# Altium schematic sheet LCDTFT_FPC40P_LVDS.SchDoc
size A3
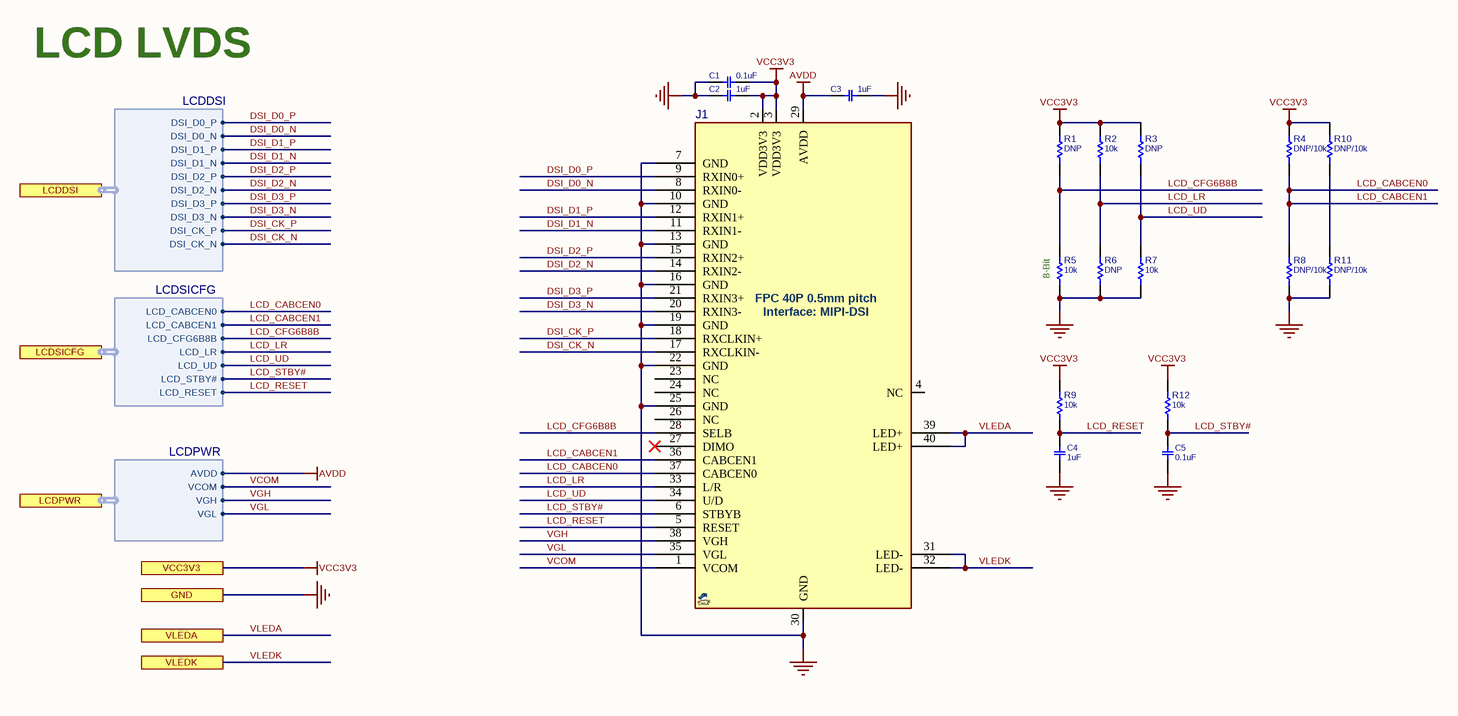
[diagram p0: LCDTFT_FPC40P_LVDS.SchDoc]

## Parts
C1  0.1uF  [C0402]
C2  1uF  [C0402]
C3  1uF  [C0402]
C4  1uF  [C0402]
C5  0.1uF  [C0402]
J1  FPC_40_0.5mm  [FPC50_40]  (value not drawn)
R1  DNP  [R0402]
R2  10k  [R0402]
R3  DNP  [R0402]
R4  DNP/10k  [R0402]
R5  10k  [R0402]
R6  DNP  [R0402]
R7  10k  [R0402]
R8  DNP/10k  [R0402]
R9  10k  [R0402]
R10  DNP/10k  [R0402]
R11  DNP/10k  [R0402]
R12  10k  [R0402]

## Ports
GND, LCDDSI (harness LCDDSI), LCDPWR (harness LCDPWR), LCDSICFG (harness LCDSICFG), VCC3V3, VLEDA, VLEDK

## Harnesses
LCDDSI: DSI_D0_P, DSI_D0_N, DSI_D1_P, DSI_D1_N, DSI_D2_P, DSI_D2_N, DSI_D3_P, DSI_D3_N, DSI_CK_P, DSI_CK_N
LCDPWR: AVDD, VGH, VCOM, VGL
LCDSICFG: LCD_CABCEN0, LCD_CABCEN1, LCD_CFG6B8B, LCD_LR, LCD_UD, LCD_STBY#, LCD_RESET

## Nets
AVDD: C3.2 J1.29(AVDD) ; port LCDPWR.AVDD
GND: C1.2 C2.2 C3.1 C4.2 C5.2 J1.7(GND) J1.10(GND) J1.13(GND) J1.16(GND) J1.19(GND) J1.22(GND) J1.25(GND) J1.30(GND) R5.2 R6.2 R7.2 R8.2 R11.2 ; port GND
VCC3V3: C1.1 C2.1 J1.2(VDD3V3) J1.3(VDD3V3) R1.1 R2.1 R3.1 R4.1 R9.1 R10.1 R12.1 ; port VCC3V3
DSI_CK_N: J1.17(RXCLKIN-) ; port LCDDSI.DSI_CK_N
DSI_CK_P: J1.18(RXCLKIN+) ; port LCDDSI.DSI_CK_P
DSI_D0_N: J1.8(RXIN0-) ; port LCDDSI.DSI_D0_N
DSI_D0_P: J1.9(RXIN0+) ; port LCDDSI.DSI_D0_P
DSI_D1_N: J1.11(RXIN1-) ; port LCDDSI.DSI_D1_N
DSI_D1_P: J1.12(RXIN1+) ; port LCDDSI.DSI_D1_P
DSI_D2_N: J1.14(RXIN2-) ; port LCDDSI.DSI_D2_N
DSI_D2_P: J1.15(RXIN2+) ; port LCDDSI.DSI_D2_P
DSI_D3_N: J1.20(RXIN3-) ; port LCDDSI.DSI_D3_N
DSI_D3_P: J1.21(RXIN3+) ; port LCDDSI.DSI_D3_P
LCD_CABCEN0: J1.36(CABCEN1) J1.37(CABCEN0) R4.2 R8.1 ; port LCDSICFG.LCD_CABCEN0, port LCDSICFG.LCD_CABCEN1  [also labelled LCD_CABCEN1]
LCD_CFG6B8B: J1.28(SELB) R1.2 R5.1 ; port LCDSICFG.LCD_CFG6B8B
LCD_LR: J1.33(L/R) R2.2 R6.1 ; port LCDSICFG.LCD_LR
LCD_RESET: C4.1 J1.5(RESET) R9.2 ; port LCDSICFG.LCD_RESET
LCD_STBY#: C5.1 J1.6(STBYB) R12.2 ; port LCDSICFG.LCD_STBY#
LCD_UD: J1.34(U/D) R3.2 R7.1 ; port LCDSICFG.LCD_UD
VCOM: J1.1(VCOM) ; port LCDPWR.VCOM
VGH: J1.38(VGH) ; port LCDPWR.VGH
VGL: J1.35(VGL) ; port LCDPWR.VGL
VLEDA: J1.39(LED+) J1.40(LED+) ; port VLEDA
VLEDK: J1.31(LED-) J1.32(LED-) ; port VLEDK
NetR10_2: R10.2 R11.1

Not connected (* = marked no-connect by the designer): J1 4(NC) 23(NC) 24(NC) 26(NC) 27(DIMO)*

## Notes on the sheet
- LCD LVDS
- (near R5) 8-Bit
- (in symbol LCDTFT_DSI_FPC40P) FPC 40P 0.5mm pitch; Interface: MIPI-DSI

## Library data of the parts
C1 C5 = CAP_SMD_MLCC: CAP, MLCC; PARAM: X7R, 10%, -55~125oC; MANF_P#: GRM155R71H104KE14D; MANF: Murata; PARAM2: 50v; PRICE: 100: 0.018$; ASSEMBLY: ASSEMBLY; VALUE: 0.1uF
C2-C4 = CAP_SMD_MLCC: CAP, MLCC; PARAM: X5R, 10%; MANF_P#: CL05A105KO5NNND; MANF: Samsung; PARAM2: 16v; PRICE: 50,000:	$0.006; ASSEMBLY: ASSEMBLY; VALUE: 1uF
J1 = LCDTFT_DSI_FPC40P: LCD TFT Color, FPC40P, LVDS; MANF: -; MANF_P#: -; PARAM: -; VALUE: FPC_40_0.5mm
R1-R12 = RES_SMD: RESISTOR, SMD; PARAM: 0.063W; DESC: DESCRIPTION; DIST#: MOUSER; PARAM2: 1%; MANF_P#: -; MANF: -; ASSEMBLY: ASSEMBLY; PRICE: 100= 0.3$
  R1 R3 R6: VALUE: DNP
  R2 R5 R7 R9 R12: VALUE: 10k
  R4 R8 R10 R11: VALUE: DNP/10k